# Altium project CPAP_POWER.PrjPcb (part 1 of 2)
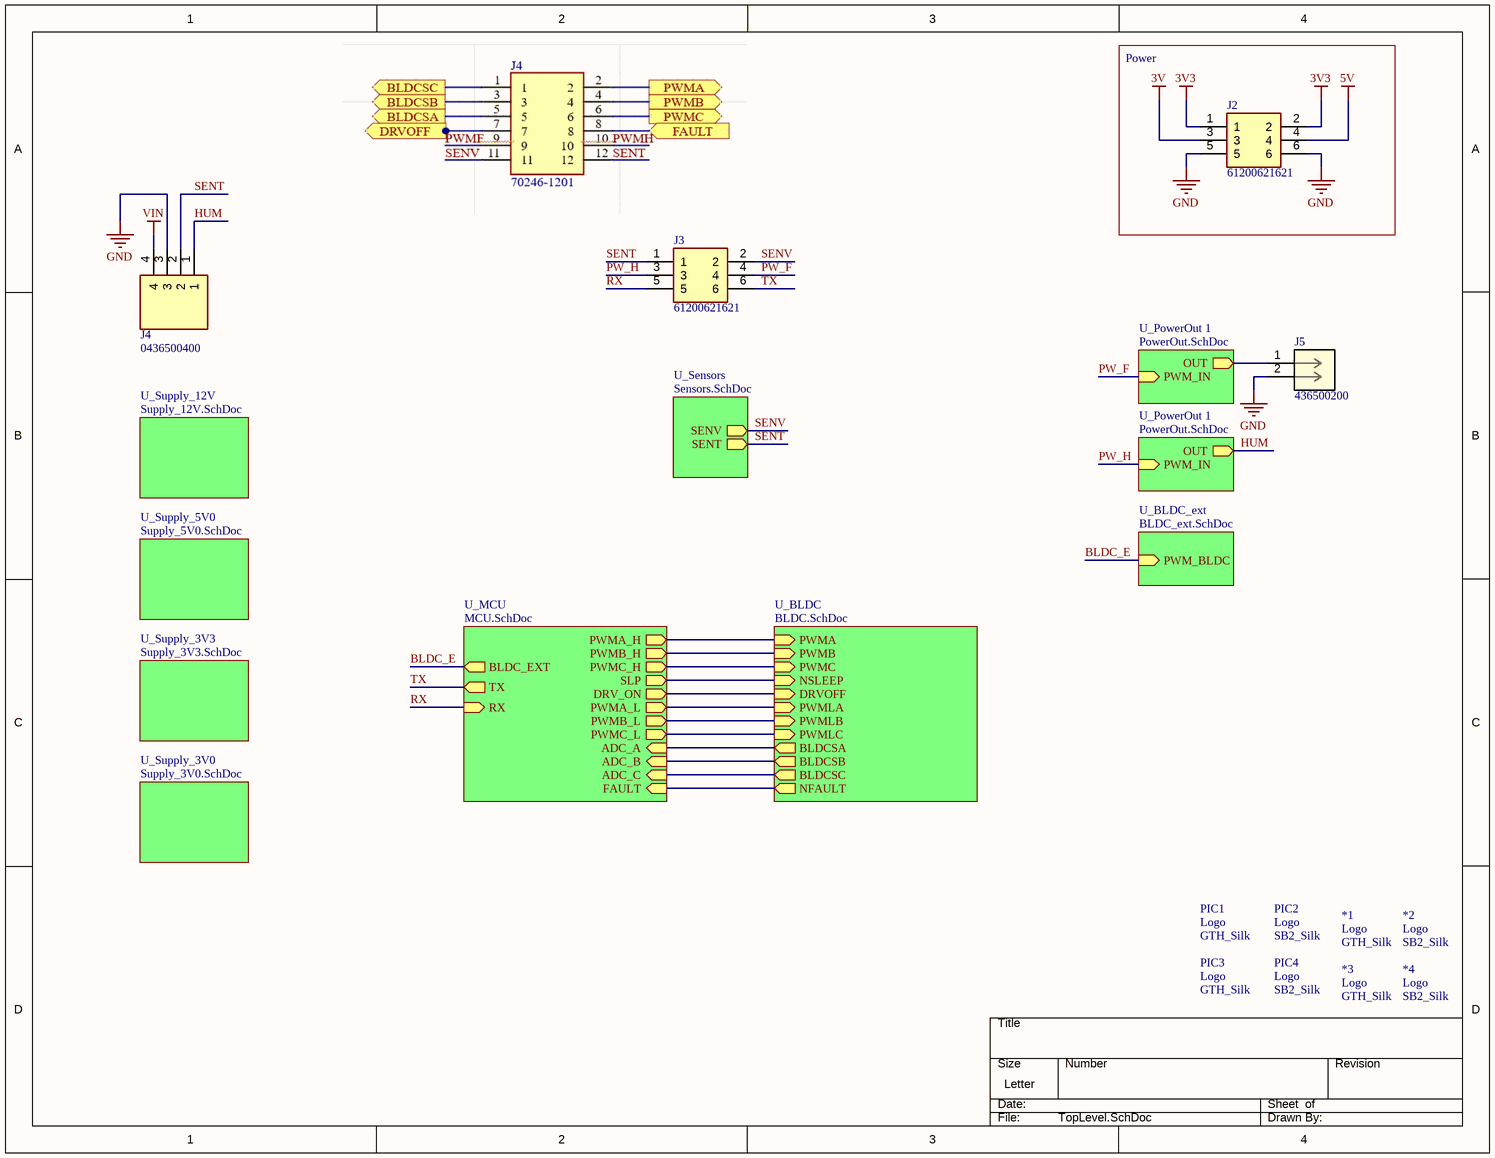
[diagram p0: TopLevel.SchDoc]
10 sheets, 101 parts. Net scope: hierarchical (ports join the sheet entries above them; power ports are global).
Board file: PCB_POWER.PcbDoc
Sheets:
  TopLevel.SchDoc
    U_Supply_5V0 = Supply_5V0.SchDoc
    U_Supply_12V = Supply_12V.SchDoc
    U_Supply_3V3 = Supply_3V3.SchDoc
    U_Supply_3V0 = Supply_3V0.SchDoc
    U_PowerOut 1 = PowerOut.SchDoc
    U_BLDC_ext = BLDC_ext.SchDoc
    U_BLDC = BLDC.SchDoc
    U_PowerOut 1 = PowerOut.SchDoc
    U_MCU = MCU.SchDoc
    U_Sensors = Sensors.SchDoc

## Sheet TopLevel.SchDoc
size Letter

### Parts
*1  GTH_Silk  [TECHHUB_SILK]
*2  SB2_Silk  [SMARTBEDDING2_SILK]
*3  GTH_Silk  [TECHHUB_SILK]
*4  SB2_Silk  [SMARTBEDDING2_SILK]
J2  61200621621  [SHDR6W64P254_2X3_1528X910X910P]
J3  61200621621  [SHDR6W64P254_2X3_1528X910X910P]
J4  0436500400  [MOLEX_0436500400]
J5  436500200  [CONN_SD-43650-001_02_MOL]
PIC1  GTH_Silk  [TECHHUB_SILK]
PIC2  SB2_Silk  [SMARTBEDDING2_SILK]
PIC3  GTH_Silk  [TECHHUB_SILK]
PIC4  SB2_Silk  [SMARTBEDDING2_SILK]

### Blocks framed on the sheet
Power: J2

### Sub-sheets
U_BLDC = BLDC.SchDoc: PWMA (in), PWMB (in), PWMC (in), NSLEEP (in), BLDCSA (out), BLDCSB (out), BLDCSC (out), NFAULT (out), DRVOFF (in), PWMLA (in), PWMLB (in), PWMLC (in)
U_BLDC_ext = BLDC_ext.SchDoc: PWM_BLDC (in)
U_MCU = MCU.SchDoc: PWMA_L (out), PWMB_L (out), PWMC_L (out), PWMA_H (out), PWMB_H (out), PWMC_H (out), ADC_A (in), ADC_B (in), ADC_C (in), FAULT (in), SLP (out), DRV_ON (out), BLDC_EXT (out), TX (out), RX (in)
U_PowerOut 1 = PowerOut.SchDoc: PWM_IN (in), OUT (out)
U_PowerOut 1 = PowerOut.SchDoc: PWM_IN (in), OUT (out)
U_Sensors = Sensors.SchDoc: SENV (out), SENT (out)
U_Supply_3V0 = Supply_3V0.SchDoc: no entries
U_Supply_3V3 = Supply_3V3.SchDoc: no entries
U_Supply_5V0 = Supply_5V0.SchDoc: no entries
U_Supply_12V = Supply_12V.SchDoc: no entries

### Nets
3V: J2.3
3V3: J2.1 J2.2
5V: J2.4
GND: J2.5 J2.6 J4.3 J5.2
VIN: J4.4
BLDC_E: sheet U_BLDC_ext/PWM_BLDC, sheet U_MCU/BLDC_EXT
FAULT: sheet U_BLDC/NFAULT, sheet U_MCU/FAULT
HUM: J4.1 ; sheet U_PowerOut 1/OUT
PW_F: J3.4 ; sheet U_PowerOut 1/PWM_IN
PW_H: J3.3 ; sheet U_PowerOut 1/PWM_IN
RX: J3.5 ; sheet U_MCU/RX
SENT: J3.1 J4.2 ; sheet U_Sensors/SENT
SENV: J3.2 ; sheet U_Sensors/SENV
TX: J3.6 ; sheet U_MCU/TX
NetC6_2: sheet U_BLDC/BLDCSA, sheet U_MCU/ADC_A
NetC7_2: sheet U_BLDC/BLDCSB, sheet U_MCU/ADC_B
NetC10_2: sheet U_BLDC/BLDCSC, sheet U_MCU/ADC_C
NetJ5_1: J5.1 ; sheet U_PowerOut 1/OUT
NetU1_21: sheet U_BLDC/DRVOFF, sheet U_MCU/DRV_ON
NetU1_23: sheet U_BLDC/NSLEEP, sheet U_MCU/SLP
NetU1_27: sheet U_BLDC/PWMA, sheet U_MCU/PWMA_H
NetU1_28: sheet U_BLDC/PWMLA, sheet U_MCU/PWMA_L
NetU1_29: sheet U_BLDC/PWMB, sheet U_MCU/PWMB_H
NetU1_30: sheet U_BLDC/PWMLB, sheet U_MCU/PWMB_L
NetU1_31: sheet U_BLDC/PWMC, sheet U_MCU/PWMC_H
NetU1_32: sheet U_BLDC/PWMLC, sheet U_MCU/PWMC_L

### Notes on the sheet
- DWG. NO.
- REV.
- SHT.
- REVISION
- DESCRIPTION
- DATE
- APPROVED
- THIS DOCUMENT AND THE DATA DISCLOSED HEREIN OR HEREWITH IS THE PROPERTY OF ALTIUM LIMITED AND MAY BE FREELY DISTRIBUTED IN WHOLE. NO RIGHTS ARE RESERVED OR EXPRESS OR IMPLIED WARANTEE GIVEN.
- ENG:
- DSN:
- APPROVALS
- PROJECT
- DOCUMENT REVISION:
- DESIGN ITEM:
- CHK:
- BOM:
- REFERENCE DOCUMENTS
- PROJECT REVISION:
- TITLE
- FAB DWG:
- PCB DWG:
- ASSY DWG:
- SCALE:
- SIZE
- C
- CAGE CODE
- FILE NAME
- DWG NO.
- SHEET
- OF
- REV
- (in symbol GTH_Silk) Logo
- (in symbol SB2_Silk) Logo

### Library data of the parts
J2 J3 = 61200621621: Wurth Elektronik PCB Header WR-BHD, 6 Way, 2.54mm Pitch, 2 Row, Straight, Through Hole; Geometry.Height: 9.1mm; Manufacturer_Name: Wurth Elektronik; Manufacturer_Part_Number: 61200621621; Mouser Part Number: 710-61200621621; Mouser Price/Stock: https://www.mouser.co.uk/ProductDetail/Wurth-Elektronik/61200621621?qs=PhR8RmCirEbjX8n1RKw4Jw%3D%3D; Arrow Part Number: *; Arrow Price/Stock: *; Datasheet Link: https://katalog.we-online.de/em/datasheet/6120xx21621.pdf
J4 = 0436500400: Micro-fit 3.0 Connector, 4 Circuit Single Row, Right Angle Throughhole PCB, Snap-In Peg; MF: Molex; MP: 0436500400; SnapEDA_Link: https://www.snapeda.com/parts/0436500400/Molex/view-part/1776823/?ref=snap; Price: None; Package: None; Availability: Unavailable; Value: *
J5 = 436500200: No Description Available; Mfr_Name: Molex Connector Corporation; RefDes: RefDes; Type: Type

## Sheet Supply_5V0.SchDoc
size Letter
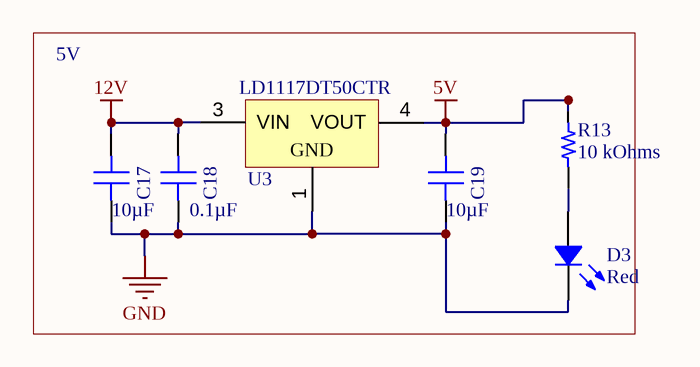
[diagram p1: Supply_5V0.SchDoc]

### Parts
C17  10µF  [CAP 0805_2012]
C18  Capacitance: 0.1µF  [CAP 0805_2012]
C19  10µF  [CAP 0805_2012]
D3  Red  [LED 0603_1608 RED]
R13  10 kOhms  [YAGEO RES 0603_1608]
U3  LD1117DT50CTR  [DPAK456P1010X240-3N]

### Blocks framed on the sheet
5V: C17-C19 D3 R13 U3

### Nets
5V: C19.1 R13.2 U3.4(VOUT)
12V: C17.1 C18.1 U3.3(VIN)
GND: C17.2 C18.2 C19.2 D3.2 U3.1(GND)
NetD3_1: D3.1 R13.1

### Notes on the sheet
- DWG. NO.
- REV.
- SHT.
- REVISION
- DESCRIPTION
- DATE
- APPROVED
- THIS DOCUMENT AND THE DATA DISCLOSED HEREIN OR HEREWITH IS THE PROPERTY OF ALTIUM LIMITED AND MAY BE FREELY DISTRIBUTED IN WHOLE. NO RIGHTS ARE RESERVED OR EXPRESS OR IMPLIED WARANTEE GIVEN.
- ENG:
- DSN:
- APPROVALS
- PROJECT
- DOCUMENT REVISION:
- DESIGN ITEM:
- CHK:
- BOM:
- REFERENCE DOCUMENTS
- PROJECT REVISION:
- TITLE
- FAB DWG:
- PCB DWG:
- ASSY DWG:
- SCALE:
- SIZE
- C
- CAGE CODE
- FILE NAME
- DWG NO.
- SHEET
- OF
- REV

### Library data of the parts
C17 C19 = 0805YD106KAT2A: CAP CER 10UF 16V X5R 0805; manufacturer: AVX Corporation; Tolerance: ±10%; value: 10µF; Part Number: 0805YD106KAT2A; Applications: General Purpose; componentlink1description: Datasheet; componentlink1url: http://datasheets.avx.com/cx5r.pdf; componentlink2description: DigiKey Link; componentlink2url: http://digikey.com/product-detail/en/avx-corporation/0805YD106KAT2A/478-5165-1-ND/1913255; Device Package: 0805 (2012 Metric); lastupdated: 2020-09-02 01:04:16; Lifecycle Status: Active; Minimum Order: 1; Mounting Type: Surface Mount, MLCC; Operating Temperature: -55°C ~ 85°C; Package / Case: 0805 (2012 Metric); packaging: TapeAndReel; partid: 15295; Part Status: Active; price: 0.16; series: -; Size / Dimension: 0.079" L x 0.049" W (2.01mm x 1.25mm); Supplier 1: DigiKey; Supplier Part Number 1: 478-5165-1-ND; Temperature Coefficient: X5R; Thickness (Max): 0.055" (1.40mm); Voltage - Rated: 16V
C18 = 08053E104ZAT2A: CAP CER 0.1UF 25V Z5U 0805; manufacturer: AVX Corporation; Tolerance: -20%, +80%; Part Number: 08053E104ZAT2A; Applications: General Purpose; componentlink2description: DigiKey Link; componentlink2url: http://digikey.com/product-detail/en/avx-corporation/08053E104ZAT2A/478-12769-1-ND/9949310; Device Package: 0805 (2012 Metric); lastupdated: 2020-09-02 01:04:40; Lifecycle Status: Active; Minimum Order: 1; Mounting Type: Surface Mount, MLCC; Operating Temperature: 10°C ~ 85°C; Package / Case: 0805 (2012 Metric); packaging: TapeAndReel; partid: 3602; Part Status: Active; price: 0.04; series: -; Size / Dimension: 0.079" L x 0.049" W (2.00mm x 1.25mm); Supplier 1: DigiKey; Supplier Part Number 1: 478-12769-1-ND; Temperature Coefficient: Z5U; Thickness (Max): 0.037" (0.94mm); Voltage - Rated: 25V
D3 = LR Q976.01-P2R2-1: LED RED CLEAR 0603 SMD; Manufacturer: ams-OSRAM USA Inc.; Current - Test: 20mA; Lens Color: Colorless; Lens Size: 1.10mm x 0.80mm; Lens Style: Rectangle with Flat Top; Millicandela Rating: 118mcd; Viewing Angle: 140°; Voltage - Forward (Vf) (Typ): 2V; Wavelength - Dominant: 623nm; Wavelength - Peak: 628nm; Part Number: LR Q976.01-P2R2-1; Color: Red; ComponentLink2Description: DigiKey Link; ComponentLink2URL: https://www.digikey.com/en/products/detail/ams-osram-usa-inc/LR-Q976-01-P2R2-1/21556490; Device Package: 0603 (1608 Metric); Height (Max): 0.75mm; LastUpdated: 2024-06-03 19:59:37; Lens Transparency: Clear; Lifecycle Status: Active; Minimum Order: 1; Mounting Type: Surface Mount; Package / Case: 0603 (1608 Metric); Packaging: TapeAndReel; PartId: 1467; Price: 0.02; Series: LO Q976.01; Size / Dimension: 1.60mm L x 0.80mm W; Supplier 1: DigiKey; Supplier Part Number 1: 475-LRQ976.01-P2R2-1CT-ND; Supplier Device Package: 0603; Value: Red
R13 = AC0603JR-0710KL: RES SMD 10K OHM 5% 1/10W 0603; Manufacturer: Yageo; Power (Watts): 0.1W, 1/10W; Temperature Coefficient: ±100ppm/°C; Part Number: AC0603JR-0710KL; Value: 10 kOhms; ComponentLink1Description: Datasheet; ComponentLink1URL: https://www.yageo.com/upload/media/product/productsearch/datasheet/rchip/PYu-AC_51_RoHS_L_7.pdf; ComponentLink2Description: DigiKey Link; ComponentLink2URL: https://www.digikey.com/en/products/detail/yageo/AC0603JR-0710KL/2827830; Composition: Thick Film; Device Package: 0603 (1608 Metric); Features: Automotive AEC-Q200, Moisture Resistant; Height - Seated (Max): 0.022" (0.55mm); LastUpdated: 2024-07-25 09:19:28; Lifecycle Status: Active; Minimum Order: 1; Number of Terminations: 2; Operating Temperature: -55°C ~ 155°C; Package / Case: 0603 (1608 Metric); Packaging: CutTape; PartId: 12247; Part Status: Active; Price: 0.01; Ratings: AEC-Q200; Resistance: 10 kOhms; Series: AC; Size / Dimension: 0.063" L x 0.031" W (1.60mm x 0.80mm); Supplier 1: DigiKey; Supplier Part Number 1: 311-10KLECT-ND; Supplier Device Package: 0603; Tolerance: ±5%
U3 = LD1117DT50CTR: Fixed Low Drop Positive Voltage Regulator, 5V, 3-Pin DPAK, Tape and Reel; ComponentLink1Description: Manufacturer URL; ComponentLink2Description: Datasheet; DatasheetVersion: 1/11/2011; ComponentLink1URL: http://www.st.com; PackageVersion: 2011; PackageDescription: 3-Pin Transistor Outline Package 2.28 mm Pitch, 9.7 mm Lead Span (DPAK); ComponentLink2URL: http://www.st.com/internet/com/TECHNICAL_RESOURCES/TECHNICAL_LITERATURE/DATASHEET/CD00000544.pdf; PackageReference: TO-252; PartNumber: LD1117DT50CTR

## Sheet Supply_12V.SchDoc
size Letter
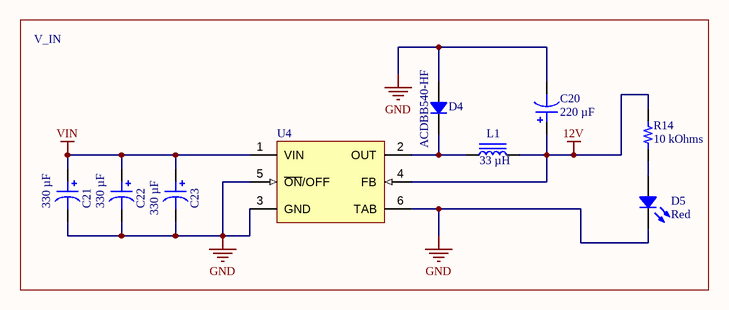
[diagram p2: Supply_12V.SchDoc]

### Parts
C20  220 µF  [CAP ALSMD 8.3MM H10.5MM]
C21  330 µF  [CAP ALSMD 8.3MM H10.5MM]
C22  330 µF  [CAP ALSMD 8.3MM H10.5MM]
C23  330 µF  [CAP ALSMD 8.3MM H10.5MM]
D4  ACDBB540-HF  [DO214AA SMB]
D5  Red  [LED 0603_1608 RED]
L1  33 µH  [BOURNS SRR1280]
R14  10 kOhms  [YAGEO RES 0603_1608]
U4  (no value)  [KTT0005B_M]

### Blocks framed on the sheet
V_IN: C20-C23 D4 D5 L1 R14 U4

### Nets
12V: C20.1 L1.2 R14.2 U4.4(FB)
GND: C20.2 C21.2 C22.2 C23.2 D4.1 D5.2 U4.3(GND) U4.5(~{ON}/OFF) U4.6(TAB)
VIN: C21.1 C22.1 C23.1 U4.1(VIN)
NetD4_2: D4.2 L1.1 U4.2(OUT)
NetD5_1: D5.1 R14.1

### Notes on the sheet
- DWG. NO.
- REV.
- SHT.
- REVISION
- DESCRIPTION
- DATE
- APPROVED
- THIS DOCUMENT AND THE DATA DISCLOSED HEREIN OR HEREWITH IS THE PROPERTY OF ALTIUM LIMITED AND MAY BE FREELY DISTRIBUTED IN WHOLE. NO RIGHTS ARE RESERVED OR EXPRESS OR IMPLIED WARANTEE GIVEN.
- ENG:
- DSN:
- APPROVALS
- PROJECT
- DOCUMENT REVISION:
- DESIGN ITEM:
- CHK:
- BOM:
- REFERENCE DOCUMENTS
- PROJECT REVISION:
- TITLE
- FAB DWG:
- PCB DWG:
- ASSY DWG:
- SCALE:
- SIZE
- C
- CAGE CODE
- FILE NAME
- DWG NO.
- SHEET
- OF
- REV

### Library data of the parts
C20 = 25SKV220M8X10.5: CAP ALUM 220UF 20% 25V SMD; manufacturer: Rubycon; Lifetime @ Temp.: 1000 Hrs @ 105°C; Polarization: Polar; Ripple Current @ High Frequency: 228 mA @ 10 kHz; Ripple Current @ Low Frequency: 190 mA @ 120 Hz; Surface Mount Land Size: 0.327" L x 0.327" W (8.30mm x 8.30mm); componentlink2url: https://www.digikey.com/en/products/detail/rubycon/25SKV220M8X10-5/3568724; componentlink1description: Datasheet; componentlink1url: http://www.rubycon.co.jp/en/catalog/e_pdfs/aluminum/e_SKV.pdf; componentlink2description: DigiKey Link; packaging: TapeAndReel; Part Number: 25SKV220M8X10.5; Applications: General Purpose; Capacitance: 220 µF; Device Package: Radial, Can - SMD; Height - Seated (Max): 0.413" (10.50mm); lastupdated: 2024-06-03 20:15:46; Lifecycle Status: Active; Minimum Order: 1; Mounting Type: Surface Mount; Operating Temperature: -55°C ~ 105°C; Package / Case: Radial, Can - SMD; partid: 7651; Part Status: Active; price: 0.12; series: SKV; Size / Dimension: 0.315" Dia (8.00mm); Supplier 1: DigiKey; Supplier Part Number 1: 1189-3082-1-ND; Tolerance: ±20%; value: 220 µF; Voltage - Rated: 25 V
C21-C23 = EMZS350ARA331MHA0G: CAP ALUM 330UF 20% 35V SMD; manufacturer: United Chemi-Con; ESR (Equivalent Series Resistance): 80mOhm @ 100kHz; Lifetime @ Temp.: 2000 Hrs @ 105°C; Polarization: Polar; Ripple Current @ High Frequency: 850 mA @ 100 kHz; Ripple Current @ Low Frequency: 425 mA @ 120 Hz; Surface Mount Land Size: 0.327" L x 0.327" W (8.30mm x 8.30mm); Part Number: EMZS350ARA331MHA0G; Applications: Automotive; Capacitance: 330 µF; componentlink1description: Datasheet; componentlink1url: //media.digikey.com/pdf/Data%20Sheets/United%20Chemi-Con%20PDFs/MZS_Series_NPI.pdf; componentlink2description: DigiKey Link; componentlink2url: https://www.digikey.com/en/products/detail/united-chemi-con/EMZS350ARA331MHA0G/8637077; Device Package: Radial, Can - SMD; Height - Seated (Max): 0.413" (10.50mm); lastupdated: 2024-06-03 20:15:47; Lifecycle Status: Active; Minimum Order: 1; Mounting Type: Surface Mount; Operating Temperature: -55°C ~ 105°C; Package / Case: Radial, Can - SMD; packaging: TapeAndReel; partid: 7592; Part Status: Active; price: 0.30; Ratings: AEC-Q200; series: Alchip™- MZS; Size / Dimension: 0.315" Dia (8.00mm); Supplier 1: DigiKey; Supplier Part Number 1: 565-5121-1-ND; Tolerance: ±20%; value: 330 µF; Voltage - Rated: 35 V
D4 = ACDBB540-HF: DIODE SCHOTTKY 40V 5A DO214AA; Manufacturer: Comchip Technology; Capacitance @ Vr, F: 300pF @ 4V, 1MHz; Current - Reverse Leakage @ Vr: 500 µA @ 40 V; Speed: Fast Recovery =< 500ns, > 200mA (Io); Voltage - Forward (Vf) (Max) @ If: 550 mV @ 5 A; Part Number: ACDBB540-HF; ComponentLink1Description: Datasheet; ComponentLink1URL: http://www.comchiptech.com/admin/files/product/ACDBB540-HF%20RevA196617.pdf; ComponentLink2Description: DigiKey Link; ComponentLink2URL: https://www.digikey.com/en/products/detail/comchip-technology/ACDBB540-HF/7100744; Current - Average Rectified (Io): 5A; Diode Type: Schottky; LastUpdated: 2024-06-03 19:54:00; Lifecycle Status: Active; Minimum Order: 1; Mounting Type: Surface Mount; Operating Temperature - Junction: -55°C ~ 125°C; Package / Case: DO-214AA, SMB; Packaging: TapeAndReel; PartId: 1496; Part Status: Active; Price: 0.18; Series: -; Supplier 1: DigiKey; Supplier Part Number 1: 641-1898-1-ND; Supplier Device Package: DO-214AA (SMB); Voltage - DC Reverse (Vr) (Max): 40 V
D5 = LR Q976.01-P2R2-1: as D3 on sheet Supply_5V0; Part Number: LR Q976.01-P2R2-1; Color: Red; ComponentLink2Description: DigiKey Link; ComponentLink2URL: https://www.digikey.com/en/products/detail/ams-osram-usa-inc/LR-Q976-01-P2R2-1/21556490; Device Package: 0603 (1608 Metric); Height (Max): 0.75mm; LastUpdated: 2024-06-03 19:59:37; Lens Transparency: Clear; Lifecycle Status: Active; Minimum Order: 1; Mounting Type: Surface Mount; Package / Case: 0603 (1608 Metric); Packaging: TapeAndReel; PartId: 1467; Price: 0.02; Series: LO Q976.01; Size / Dimension: 1.60mm L x 0.80mm W; Supplier 1: DigiKey; Supplier Part Number 1: 475-LRQ976.01-P2R2-1CT-ND; Supplier Device Package: 0603; Value: Red
L1 = SRR1280-330M: FIXED IND 33UH 3.5A 57 MOHM SMD; Manufacturer: Bourns Inc.; Shielding: Shielded; Tolerance: ±20%; DC Resistance (DCR): 57mOhm Max; Current - Saturation: 3.3A; Frequency - Self Resonant: 9.5MHz; Inductance Frequency - Test: 100 kHz; Material - Core: Ferrite; Q @ Freq: 28 @ 2.52MHz; Type: Drum Core, Wirewound; Series: SRR1280; Height - Seated (Max): 0.315" (8.00mm); Inductance: 33 µH; Packaging: TapeAndReel; Part Number: SRR1280-330M; ComponentLink1Description: Datasheet; ComponentLink1URL: https://www.bourns.com/docs/Product-Datasheets/SRR1280.pdf; ComponentLink2Description: DigiKey Link; ComponentLink2URL: https://www.digikey.com/en/products/detail/bourns-inc/SRR1280-330M/1969998; Current Rating (Amps): 3.5 A; Device Package: Nonstandard; LastUpdated: 2024-11-25 00:45:31; Lifecycle Status: Active; Minimum Order: 1; Mounting Type: Surface Mount; Operating Temperature: -40°C ~ 125°C; Package / Case: Nonstandard; PartId: 25; Part Status: Active; Price: 0.45; Size / Dimension: 0.492" L x 0.492" W (12.50mm x 12.50mm); Supplier 1: DigiKey; Supplier Part Number 1: SRR1280-330MCT-ND; Value: 33 µH
R14 = AC0603JR-0710KL: as R13 on sheet Supply_5V0; Part Number: AC0603JR-0710KL; Value: 10 kOhms; ComponentLink1Description: Datasheet; ComponentLink1URL: https://www.yageo.com/upload/media/product/productsearch/datasheet/rchip/PYu-AC_51_RoHS_L_7.pdf; ComponentLink2Description: DigiKey Link; ComponentLink2URL: https://www.digikey.com/en/products/detail/yageo/AC0603JR-0710KL/2827830; Composition: Thick Film; Device Package: 0603 (1608 Metric); Features: Automotive AEC-Q200, Moisture Resistant; Height - Seated (Max): 0.022" (0.55mm); LastUpdated: 2024-07-25 09:19:28; Lifecycle Status: Active; Minimum Order: 1; Number of Terminations: 2; Operating Temperature: -55°C ~ 155°C; Package / Case: 0603 (1608 Metric); Packaging: CutTape; PartId: 12247; Part Status: Active; Price: 0.01; Ratings: AEC-Q200; Resistance: 10 kOhms; Series: AC; Size / Dimension: 0.063" L x 0.031" W (1.60mm x 0.80mm); Supplier 1: DigiKey; Supplier Part Number 1: 311-10KLECT-ND; Supplier Device Package: 0603; Tolerance: ±5%
U4 = LM2576S-12/NOPB: SIMPLE SWITCHER® 3A Step-Down Voltage Regulator, 5-pin TO-263, Pb-Free; Manufacturer: Texas Instruments; PackageTopMarking: NSUZXYTTE#*LM2576S*-12 P+; PowerWise: N; ComponentLink1Description: Datasheet URL; PinCount: 5; ComponentLink1URL: http://www.ti.com/general/docs/lit/getliterature.tsp?genericPartNumber=LM2576&fileType=pdf; Code_JEDEC: MO-169-AB; PackageReference: KTT0005B; PackageDescription: TO-263, Molded, .400 x .390 x .180in, 5 Lead, .067in Pitch, Surface Mount; CompType: Switcher; RoHS: Y

## Sheet Supply_3V3.SchDoc
size Letter
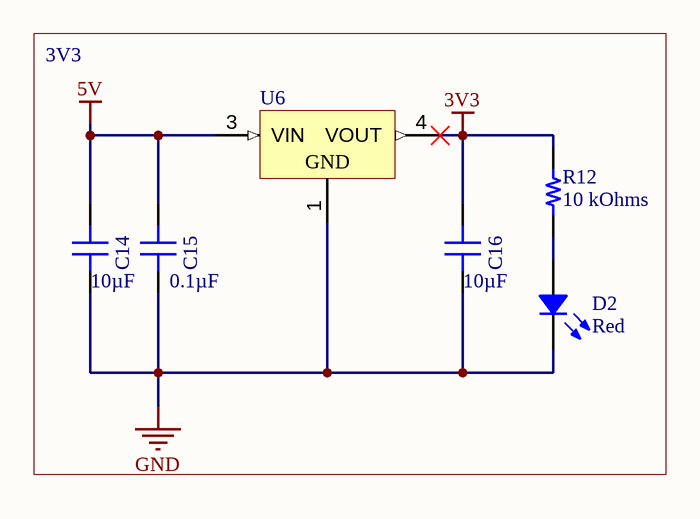
[diagram p3: Supply_3V3.SchDoc]

### Parts
C14  10µF  [CAP 0805_2012]
C15  Capacitance: 0.1µF  [CAP 0805_2012]
C16  10µF  [CAP 0805_2012]
D2  Red  [LED 0603_1608 RED]
R12  10 kOhms  [YAGEO RES 0603_1608]
U6  (no value)  [DPAK456P1010X240-3N]

### Blocks framed on the sheet
3V3: C14-C16 D2 R12 U6

### Nets
3V3: C16.1 R12.2 U6.4(VOUT)
5V: C14.1 C15.1 U6.3(VIN)
GND: C14.2 C15.2 C16.2 D2.2 U6.1(GND)
NetD2_1: D2.1 R12.1

### Notes on the sheet
- DWG. NO.
- REV.
- SHT.
- REVISION
- DESCRIPTION
- DATE
- APPROVED
- THIS DOCUMENT AND THE DATA DISCLOSED HEREIN OR HEREWITH IS THE PROPERTY OF ALTIUM LIMITED AND MAY BE FREELY DISTRIBUTED IN WHOLE. NO RIGHTS ARE RESERVED OR EXPRESS OR IMPLIED WARANTEE GIVEN.
- ENG:
- DSN:
- APPROVALS
- PROJECT
- DOCUMENT REVISION:
- DESIGN ITEM:
- CHK:
- BOM:
- REFERENCE DOCUMENTS
- PROJECT REVISION:
- TITLE
- FAB DWG:
- PCB DWG:
- ASSY DWG:
- SCALE:
- SIZE
- C
- CAGE CODE
- FILE NAME
- DWG NO.
- SHEET
- OF
- REV

### Library data of the parts
C14 C16 = 0805YD106KAT2A: as C17 on sheet Supply_5V0; value: 10µF; Part Number: 0805YD106KAT2A; Applications: General Purpose; componentlink1description: Datasheet; componentlink1url: http://datasheets.avx.com/cx5r.pdf; componentlink2description: DigiKey Link; componentlink2url: http://digikey.com/product-detail/en/avx-corporation/0805YD106KAT2A/478-5165-1-ND/1913255; Device Package: 0805 (2012 Metric); lastupdated: 2020-09-02 01:04:16; Lifecycle Status: Active; Minimum Order: 1; Mounting Type: Surface Mount, MLCC; Operating Temperature: -55°C ~ 85°C; Package / Case: 0805 (2012 Metric); packaging: TapeAndReel; partid: 15295; Part Status: Active; price: 0.16; series: -; Size / Dimension: 0.079" L x 0.049" W (2.01mm x 1.25mm); Supplier 1: DigiKey; Supplier Part Number 1: 478-5165-1-ND; Temperature Coefficient: X5R; Thickness (Max): 0.055" (1.40mm); Voltage - Rated: 16V
C15 = 08053E104ZAT2A: as C18 on sheet Supply_5V0; Part Number: 08053E104ZAT2A; Applications: General Purpose; componentlink2description: DigiKey Link; componentlink2url: http://digikey.com/product-detail/en/avx-corporation/08053E104ZAT2A/478-12769-1-ND/9949310; Device Package: 0805 (2012 Metric); lastupdated: 2020-09-02 01:04:40; Lifecycle Status: Active; Minimum Order: 1; Mounting Type: Surface Mount, MLCC; Operating Temperature: 10°C ~ 85°C; Package / Case: 0805 (2012 Metric); packaging: TapeAndReel; partid: 3602; Part Status: Active; price: 0.04; series: -; Size / Dimension: 0.079" L x 0.049" W (2.00mm x 1.25mm); Supplier 1: DigiKey; Supplier Part Number 1: 478-12769-1-ND; Temperature Coefficient: Z5U; Thickness (Max): 0.037" (0.94mm); Voltage - Rated: 25V
D2 = LR Q976.01-P2R2-1: as D3 on sheet Supply_5V0; Part Number: LR Q976.01-P2R2-1; Color: Red; ComponentLink2Description: DigiKey Link; ComponentLink2URL: https://www.digikey.com/en/products/detail/ams-osram-usa-inc/LR-Q976-01-P2R2-1/21556490; Device Package: 0603 (1608 Metric); Height (Max): 0.75mm; LastUpdated: 2024-06-03 19:59:37; Lens Transparency: Clear; Lifecycle Status: Active; Minimum Order: 1; Mounting Type: Surface Mount; Package / Case: 0603 (1608 Metric); Packaging: TapeAndReel; PartId: 1467; Price: 0.02; Series: LO Q976.01; Size / Dimension: 1.60mm L x 0.80mm W; Supplier 1: DigiKey; Supplier Part Number 1: 475-LRQ976.01-P2R2-1CT-ND; Supplier Device Package: 0603; Value: Red
R12 = AC0603JR-0710KL: as R13 on sheet Supply_5V0; Part Number: AC0603JR-0710KL; Value: 10 kOhms; ComponentLink1Description: Datasheet; ComponentLink1URL: https://www.yageo.com/upload/media/product/productsearch/datasheet/rchip/PYu-AC_51_RoHS_L_7.pdf; ComponentLink2Description: DigiKey Link; ComponentLink2URL: https://www.digikey.com/en/products/detail/yageo/AC0603JR-0710KL/2827830; Composition: Thick Film; Device Package: 0603 (1608 Metric); Features: Automotive AEC-Q200, Moisture Resistant; Height - Seated (Max): 0.022" (0.55mm); LastUpdated: 2024-07-25 09:19:28; Lifecycle Status: Active; Minimum Order: 1; Number of Terminations: 2; Operating Temperature: -55°C ~ 155°C; Package / Case: 0603 (1608 Metric); Packaging: CutTape; PartId: 12247; Part Status: Active; Price: 0.01; Ratings: AEC-Q200; Resistance: 10 kOhms; Series: AC; Size / Dimension: 0.063" L x 0.031" W (1.60mm x 0.80mm); Supplier 1: DigiKey; Supplier Part Number 1: 311-10KLECT-ND; Supplier Device Package: 0603; Tolerance: ±5%
U6 = LD1117DT33TR: Linear Voltage Regulator IC 1 Output 800mA DPAK; MF: STMicroelectronics; Package: TO-252 STMicroelectronics; Value: *; MP: LD1117DT33TR; Price: None; SnapEDA_Link: https://www.snapeda.com/parts/LD1117DT33TR/STMicroelectronics/view-part/8105/?ref=snap; Availability: Unavailable

## Sheet Supply_3V0.SchDoc
size Letter
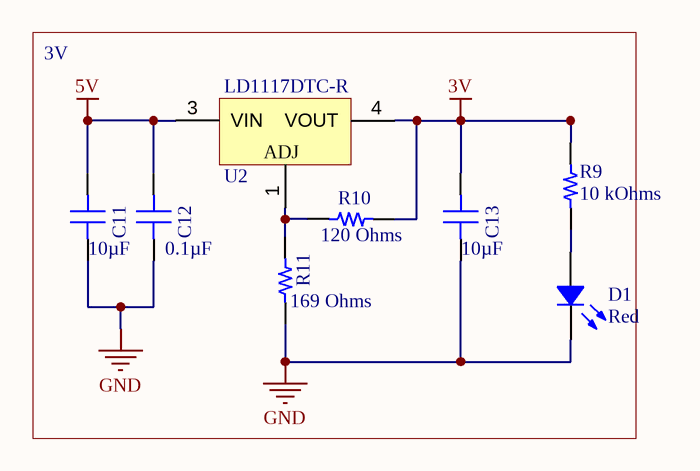
[diagram p4: Supply_3V0.SchDoc]

### Parts
C11  10µF  [CAP 0805_2012]
C12  Capacitance: 0.1µF  [CAP 0805_2012]
C13  10µF  [CAP 0805_2012]
D1  Red  [LED 0603_1608 RED]
R9  10 kOhms  [YAGEO RES 0603_1608]
R10  120 Ohms  [YAGEO RES 0603_1608]
R11  169 Ohms  [YAGEO RES 0603_1608]
U2  LD1117DTC-R  [DPAK456P1010X240-3N]

### Blocks framed on the sheet
3V: C11-C13 D1 R9-R11 U2

### Nets
3V: C13.1 R9.2 R10.2 U2.4(VOUT)
5V: C11.1 C12.1 U2.3(VIN)
GND: C11.2 C12.2 C13.2 D1.2 R11.2
NetD1_1: D1.1 R9.1
NetR10_1: R10.1 R11.1 U2.1(GND)

### Notes on the sheet
- DWG. NO.
- REV.
- SHT.
- REVISION
- DESCRIPTION
- DATE
- APPROVED
- THIS DOCUMENT AND THE DATA DISCLOSED HEREIN OR HEREWITH IS THE PROPERTY OF ALTIUM LIMITED AND MAY BE FREELY DISTRIBUTED IN WHOLE. NO RIGHTS ARE RESERVED OR EXPRESS OR IMPLIED WARANTEE GIVEN.
- ENG:
- DSN:
- APPROVALS
- PROJECT
- DOCUMENT REVISION:
- DESIGN ITEM:
- CHK:
- BOM:
- REFERENCE DOCUMENTS
- PROJECT REVISION:
- TITLE
- FAB DWG:
- PCB DWG:
- ASSY DWG:
- SCALE:
- SIZE
- C
- CAGE CODE
- FILE NAME
- DWG NO.
- SHEET
- OF
- REV
- (in symbol LD1117DTC-R) ADJ

### Library data of the parts
C11 C13 = 0805YD106KAT2A: as C17 on sheet Supply_5V0; value: 10µF; Part Number: 0805YD106KAT2A; Applications: General Purpose; componentlink1description: Datasheet; componentlink1url: http://datasheets.avx.com/cx5r.pdf; componentlink2description: DigiKey Link; componentlink2url: http://digikey.com/product-detail/en/avx-corporation/0805YD106KAT2A/478-5165-1-ND/1913255; Device Package: 0805 (2012 Metric); lastupdated: 2020-09-02 01:04:16; Lifecycle Status: Active; Minimum Order: 1; Mounting Type: Surface Mount, MLCC; Operating Temperature: -55°C ~ 85°C; Package / Case: 0805 (2012 Metric); packaging: TapeAndReel; partid: 15295; Part Status: Active; price: 0.16; series: -; Size / Dimension: 0.079" L x 0.049" W (2.01mm x 1.25mm); Supplier 1: DigiKey; Supplier Part Number 1: 478-5165-1-ND; Temperature Coefficient: X5R; Thickness (Max): 0.055" (1.40mm); Voltage - Rated: 16V
C12 = 08053E104ZAT2A: as C18 on sheet Supply_5V0; Part Number: 08053E104ZAT2A; Applications: General Purpose; componentlink2description: DigiKey Link; componentlink2url: http://digikey.com/product-detail/en/avx-corporation/08053E104ZAT2A/478-12769-1-ND/9949310; Device Package: 0805 (2012 Metric); lastupdated: 2020-09-02 01:04:40; Lifecycle Status: Active; Minimum Order: 1; Mounting Type: Surface Mount, MLCC; Operating Temperature: 10°C ~ 85°C; Package / Case: 0805 (2012 Metric); packaging: TapeAndReel; partid: 3602; Part Status: Active; price: 0.04; series: -; Size / Dimension: 0.079" L x 0.049" W (2.00mm x 1.25mm); Supplier 1: DigiKey; Supplier Part Number 1: 478-12769-1-ND; Temperature Coefficient: Z5U; Thickness (Max): 0.037" (0.94mm); Voltage - Rated: 25V
D1 = LR Q976.01-P2R2-1: as D3 on sheet Supply_5V0; Part Number: LR Q976.01-P2R2-1; Color: Red; ComponentLink2Description: DigiKey Link; ComponentLink2URL: https://www.digikey.com/en/products/detail/ams-osram-usa-inc/LR-Q976-01-P2R2-1/21556490; Device Package: 0603 (1608 Metric); Height (Max): 0.75mm; LastUpdated: 2024-06-03 19:59:37; Lens Transparency: Clear; Lifecycle Status: Active; Minimum Order: 1; Mounting Type: Surface Mount; Package / Case: 0603 (1608 Metric); Packaging: TapeAndReel; PartId: 1467; Price: 0.02; Series: LO Q976.01; Size / Dimension: 1.60mm L x 0.80mm W; Supplier 1: DigiKey; Supplier Part Number 1: 475-LRQ976.01-P2R2-1CT-ND; Supplier Device Package: 0603; Value: Red
R9 = AC0603JR-0710KL: as R13 on sheet Supply_5V0; Part Number: AC0603JR-0710KL; Value: 10 kOhms; ComponentLink1Description: Datasheet; ComponentLink1URL: https://www.yageo.com/upload/media/product/productsearch/datasheet/rchip/PYu-AC_51_RoHS_L_7.pdf; ComponentLink2Description: DigiKey Link; ComponentLink2URL: https://www.digikey.com/en/products/detail/yageo/AC0603JR-0710KL/2827830; Composition: Thick Film; Device Package: 0603 (1608 Metric); Features: Automotive AEC-Q200, Moisture Resistant; Height - Seated (Max): 0.022" (0.55mm); LastUpdated: 2024-07-25 09:19:28; Lifecycle Status: Active; Minimum Order: 1; Number of Terminations: 2; Operating Temperature: -55°C ~ 155°C; Package / Case: 0603 (1608 Metric); Packaging: CutTape; PartId: 12247; Part Status: Active; Price: 0.01; Ratings: AEC-Q200; Resistance: 10 kOhms; Series: AC; Size / Dimension: 0.063" L x 0.031" W (1.60mm x 0.80mm); Supplier 1: DigiKey; Supplier Part Number 1: 311-10KLECT-ND; Supplier Device Package: 0603; Tolerance: ±5%
R10 = RT0603DRE07120RL: RES SMD 120 OHM 0.5% 1/10W 0603; Manufacturer: Yageo; Power (Watts): 0.1W, 1/10W; Temperature Coefficient: ±50ppm/°C; Tolerance: ±0.5%; Value: 120 Ohms; Part Number: RT0603DRE07120RL; ComponentLink1Description: Datasheet; ComponentLink1URL: https://www.yageo.com/upload/media/product/productsearch/datasheet/rchip/PYu-RT_1-to-0.01_RoHS_L_11.pdf; ComponentLink2Description: DigiKey Link; ComponentLink2URL: https://www.digikey.com/en/products/detail/yageo/RT0603DRE07120RL/1074551; Composition: Thin Film; Device Package: 0603 (1608 Metric); Height - Seated (Max): 0.022" (0.55mm); LastUpdated: 2024-07-25 09:19:30; Lifecycle Status: Active; Minimum Order: 1; Number of Terminations: 2; Operating Temperature: -55°C ~ 155°C; Package / Case: 0603 (1608 Metric); Packaging: TapeAndReel; PartId: 9567; Part Status: Active; Price: 0.01; Resistance: 120 Ohms; Series: RT; Size / Dimension: 0.063" L x 0.031" W (1.60mm x 0.80mm); Supplier 1: DigiKey; Supplier Part Number 1: 311-2409-1-ND; Supplier Device Package: 0603
R11 = RT0603DRE07169RL: RES SMD 169 OHM 0.5% 1/10W 0603; Manufacturer: Yageo; Power (Watts): 0.1W, 1/10W; Temperature Coefficient: ±50ppm/°C; Tolerance: ±0.5%; Value: 169 Ohms; Part Number: RT0603DRE07169RL; ComponentLink1Description: Datasheet; ComponentLink1URL: https://www.yageo.com/upload/media/product/productsearch/datasheet/rchip/PYu-RT_1-to-0.01_RoHS_L_11.pdf; ComponentLink2Description: DigiKey Link; ComponentLink2URL: https://www.digikey.com/en/products/detail/yageo/RT0603DRE07169RL/1074609; Composition: Thin Film; Device Package: 0603 (1608 Metric); Height - Seated (Max): 0.022" (0.55mm); LastUpdated: 2024-07-25 09:19:29; Lifecycle Status: Active; Minimum Order: 1; Number of Terminations: 2; Operating Temperature: -55°C ~ 155°C; Package / Case: 0603 (1608 Metric); Packaging: TapeAndReel; PartId: 10004; Part Status: Active; Price: 0.01; Resistance: 169 Ohms; Series: RT; Size / Dimension: 0.063" L x 0.031" W (1.60mm x 0.80mm); Supplier 1: DigiKey; Supplier Part Number 1: 311-2439-1-ND; Supplier Device Package: 0603
U2 = LD1117DTC-R: Adjustable Low Drop Voltage Regulator, 1.25 to 15V, 3-Pin DPAK, Tape and Reel; ComponentLink1Description: Manufacturer URL; ComponentLink2Description: Datasheet; DatasheetVersion: 1/11/2011; ComponentLink1URL: http://www.st.com; PackageVersion: 2011; PackageDescription: 3-Pin Transistor Outline Package 2.28 mm Pitch, 9.7 mm Lead Span (DPAK); ComponentLink2URL: http://www.st.com/internet/com/TECHNICAL_RESOURCES/TECHNICAL_LITERATURE/DATASHEET/CD00000544.pdf; PackageReference: TO-252; PartNumber: LD1117DTC-R

## Sheet PowerOut.SchDoc
size Letter
Used 2 times, as channels U_PowerOut 1, U_PowerOut 1. Parts and nets are listed once, with the designators drawn on the sheet.
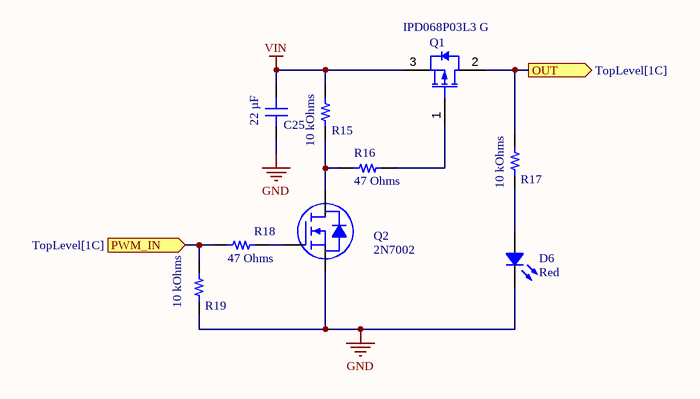
[diagram p5: PowerOut.SchDoc]

### Parts
C25  22 µF  [CAP 0805_2012]
D6  Red  [LED 0603_1608 RED]
Q1  IPD068P03L3 G  [INF-PG-TO252-3-1_M]
Q2  2N7002  [ON SEMI SOT-23-3]
R15  10 kOhms  [YAGEO RES 0603_1608]
R16  47 Ohms  [YAGEO RES 0603_1608]
R17  10 kOhms  [YAGEO RES 0603_1608]
R18  47 Ohms  [YAGEO RES 0603_1608]
R19  10 kOhms  [YAGEO RES 0603_1608]

### Ports
OUT (out, see TopLevel[1C]), PWM_IN (in, see TopLevel[1C])

### Nets
GND: C25.2 D6.2 Q2.2(S) R19.2
VIN: C25.1 Q1.3(SOURCE) R15.1
OUT: Q1.2(DRAIN) R17.1 ; port OUT
PWM_IN: R18.1 R19.1 ; port PWM_IN
NetD6_1: D6.1 R17.2
NetQ1_1: Q1.1(GATE) R16.2
NetQ2_1: Q2.1(G) R18.2
NetQ2_3: Q2.3(D) R15.2 R16.1

### Channels
U_PowerOut 1: designators end in _2; ports OUT=HUM PWM_IN=PW_H
U_PowerOut 1: designators end in _1; ports OUT=NetJ5_1 PWM_IN=PW_F

### Notes on the sheet
- DWG. NO.
- REV.
- SHT.
- REVISION
- DESCRIPTION
- DATE
- APPROVED
- THIS DOCUMENT AND THE DATA DISCLOSED HEREIN OR HEREWITH IS THE PROPERTY OF ALTIUM LIMITED AND MAY BE FREELY DISTRIBUTED IN WHOLE. NO RIGHTS ARE RESERVED OR EXPRESS OR IMPLIED WARANTEE GIVEN.
- ENG:
- DSN:
- APPROVALS
- PROJECT
- DOCUMENT REVISION:
- DESIGN ITEM:
- CHK:
- BOM:
- REFERENCE DOCUMENTS
- PROJECT REVISION:
- TITLE
- FAB DWG:
- PCB DWG:
- ASSY DWG:
- SCALE:
- SIZE
- C
- CAGE CODE
- FILE NAME
- DWG NO.
- SHEET
- OF
- REV

### Library data of the parts
C25 = GMC21X5R226M35NT: CAP0805 X5R 22UF 20% 35V; manufacturer: Cal-Chip Electronics, Inc.; Tolerance: ±20%; value: 22 µF; Part Number: GMC21X5R226M35NT; Applications: General Purpose; componentlink1description: Datasheet; componentlink1url: https://88ce57.p3cdn1.secureserver.net/wp-content/uploads/2023/01/gmc_series-2.pdf; componentlink2description: DigiKey Link; componentlink2url: https://www.digikey.com/en/products/detail/cal-chip-electronics-inc/GMC21X5R226M35NT/18151151; Device Package: 0805 (2012 Metric); lastupdated: 2024-02-09 20:14:42; Lifecycle Status: Active; Minimum Order: 1; Mounting Type: Surface Mount, MLCC; Operating Temperature: -55°C ~ 85°C; Package / Case: 0805 (2012 Metric); packaging: TapeAndReel; partid: 49838; Part Status: Active; price: 0.21; series: GMC; Size / Dimension: 0.079" L x 0.049" W (2.00mm x 1.25mm); Supplier 1: DigiKey; Supplier Part Number 1: 4713-GMC21X5R226M35NTCT-ND; Temperature Coefficient: X5R; Thickness (Max): 0.057" (1.45mm); Voltage - Rated: 35V
D6 = LR Q976.01-P2R2-1: as D3 on sheet Supply_5V0; Part Number: LR Q976.01-P2R2-1; Color: Red; ComponentLink2Description: DigiKey Link; ComponentLink2URL: https://www.digikey.com/en/products/detail/ams-osram-usa-inc/LR-Q976-01-P2R2-1/21556490; Device Package: 0603 (1608 Metric); Height (Max): 0.75mm; LastUpdated: 2024-06-03 19:59:37; Lens Transparency: Clear; Lifecycle Status: Active; Minimum Order: 1; Mounting Type: Surface Mount; Package / Case: 0603 (1608 Metric); Packaging: TapeAndReel; PartId: 1467; Price: 0.02; Series: LO Q976.01; Size / Dimension: 1.60mm L x 0.80mm W; Supplier 1: DigiKey; Supplier Part Number 1: 475-LRQ976.01-P2R2-1CT-ND; Supplier Device Package: 0603; Value: Red
Q1 = IPD068P03L3 G: P-Channel OptiMOS P3 Power-Transistor, -30 V VDS, -70 A ID, -55 to 175 degC, PG-TO252-3-1, Reel, Green; Manufacturer: Infineon; VGS(th) (min): -1Â V; RDS (on) (max): 6.8Â mOhm; Pto t (max): 100Â W; RDS (on) (max) (@4.5V): 11Â mOhm; VGS(th) (max): -2Â V; VDS (max): -30Â V; Green: TRUE; ID (max): -70Â A; IDpuls (max): -280Â A; Rth: 1.5Â K/W; RthJC (max): 1.5 K/W; QG: 68Â nC; PartNumber: IPD068P03L3 G; ComponentLink1Description: Manufacturer URL; ComponentLink2Description: Datasheet; DatasheetVersion: Rev. 2.0; ComponentLink3URL: http://www.infineon.com/dgdl/TLE42744_DS_11.pdf?folderId=db3a304318f3fe290118f5a433570040&fileId=db3a304327b897500128012ccafe37d2&sId=db3a30443d67b5ca013d83f7c0ea327b; ComponentLink1URL: http://www.infineon.com/; Packing: Reel; ComponentLink2URL: http://www.infineon.com/dgdl/IPD068P03L3+G_2+0.pdf?folderId=db3a304314dca38901154a7313d21a66&fileId=db3a30432313ff5e01232cc234f07d94; ComponentLink3Description: Package Specification; PackageVersion: Jan-10; Mounting Technology: Surface Mount; PackageReference: PG-TO252-3-1; PackageDescription: 3-Pin Plastic (Green) Transistor Single Outline Package, 6.5 x 6.12 mm Body, 2.28 mm Pitch
Q2 = 2N7002: MOSFET N-CH 60V 115MA SOT-23; Manufacturer: ON Semiconductor; Current - Continuous Drain (Id) @ 25°C: 115mA (Ta); Drive Voltage (Max Rds On,  Min Rds On): 5V, 10V; FET Type: N-Channel; Input Capacitance (Ciss) (Max) @ Vds: 50pF @ 25V; Power Dissipation (Max): 200mW (Ta); Rds On (Max) @ Id, Vgs: 7.5Ohm @ 500mA, 10V; Vgs (Max): ±20V; Vgs(th) (Max) @ Id: 2.5V @ 250µA; ComponentLink2Description: DigiKey Link; ComponentLink1URL: https://www.onsemi.com/pub/Collateral/NDS7002A-D.PDF; ComponentLink1Description: Datasheet; ComponentLink2URL: http://digikey.com/product-detail/en/on-semiconductor/2N7002/2N7002NCT-ND/244664; Part Number: 2N7002; Drain to Source Voltage (Vdss): 60V; LastUpdated: 2024-06-03 20:15:26; Lifecycle Status: Active; Minimum Order: 1; Mounting Type: Surface Mount; Operating Temperature: -55°C ~ 150°C (TJ); Package / Case: TO-236-3, SC-59, SOT-23-3; Packaging: TapeAndReel; Part Status: Active; Price: 0.06; Series: -; Supplier 1: DigiKey; Supplier Part Number 1: 2N7002NCT-ND; Supplier Device Package: SOT-23 (TO-236AB); Technology: MOSFET (Metal Oxide)
R15 = AC0603FR-0710KL: RES SMD 10K OHM 1% 1/10W 0603; Manufacturer: Yageo; Power (Watts): 0.1W, 1/10W; Temperature Coefficient: ±100ppm/°C; Tolerance: ±1%; Value: 10 kOhms; Part Number: AC0603FR-0710KL; ComponentLink1Description: Datasheet; ComponentLink1URL: https://www.yageo.com/upload/media/product/productsearch/datasheet/rchip/PYu-AC_51_RoHS_L_7.pdf; ComponentLink2Description: DigiKey Link; ComponentLink2URL: https://www.digikey.com/en/products/detail/yageo/AC0603FR-0710KL/2827814; Composition: Thick Film; Device Package: 0603 (1608 Metric); Features: Automotive AEC-Q200, Moisture Resistant; Height - Seated (Max): 0.022" (0.55mm); LastUpdated: 2024-07-25 09:19:24; Lifecycle Status: Active; Minimum Order: 1; Number of Terminations: 2; Operating Temperature: -55°C ~ 155°C; Package / Case: 0603 (1608 Metric); Packaging: CutTape; PartId: 17347; Part Status: Active; Price: 0.01; Ratings: AEC-Q200; Resistance: 10 kOhms; Series: AC; Size / Dimension: 0.063" L x 0.031" W (1.60mm x 0.80mm); Supplier 1: DigiKey; Supplier Part Number 1: 311-10KLDCT-ND; Supplier Device Package: 0603
R16 = AC0603FR-0747RL: RES SMD 47 OHM 1% 1/10W 0603; Manufacturer: Yageo; Power (Watts): 0.1W, 1/10W; Temperature Coefficient: ±100ppm/°C; Tolerance: ±1%; Value: 47 Ohms; Part Number: AC0603FR-0747RL; ComponentLink1Description: Datasheet; ComponentLink1URL: https://www.yageo.com/upload/media/product/productsearch/datasheet/rchip/PYu-AC_51_RoHS_L_7.pdf; ComponentLink2Description: DigiKey Link; ComponentLink2URL: https://www.digikey.com/en/products/detail/yageo/AC0603FR-0747RL/2827825; Composition: Thick Film; Device Package: 0603 (1608 Metric); Features: Automotive AEC-Q200, Moisture Resistant; Height - Seated (Max): 0.022" (0.55mm); LastUpdated: 2024-07-25 09:19:23; Lifecycle Status: Active; Minimum Order: 1; Number of Terminations: 2; Operating Temperature: -55°C ~ 155°C; Package / Case: 0603 (1608 Metric); Packaging: CutTape; PartId: 17426; Part Status: Active; Price: 0.01; Ratings: AEC-Q200; Resistance: 47 Ohms; Series: AC; Size / Dimension: 0.063" L x 0.031" W (1.60mm x 0.80mm); Supplier 1: DigiKey; Supplier Part Number 1: 311-47LDCT-ND; Supplier Device Package: 0603
R17 = RV0603FR-0710KL: RES SMD 10K OHM 1% 1/10W 0603; Manufacturer: Yageo; Power (Watts): 0.1W, 1/10W; Temperature Coefficient: ±200ppm/°C; Tolerance: ±1%; Value: 10 kOhms; Part Number: RV0603FR-0710KL; ComponentLink1Description: Datasheet; ComponentLink1URL: https://www.yageo.com/upload/media/product/productsearch/datasheet/rchip/PYu-RV_51_RoHS_L_12.pdf; ComponentLink2Description: DigiKey Link; ComponentLink2URL: https://www.digikey.com/en/products/detail/yageo/RV0603FR-0710KL/5947844; Composition: Thick Film; Device Package: 0603 (1608 Metric); Features: Automotive AEC-Q200, High Voltage; Height - Seated (Max): 0.022" (0.55mm); LastUpdated: 2024-07-25 09:18:51; Lifecycle Status: Active; Minimum Order: 1; Number of Terminations: 2; Operating Temperature: -55°C ~ 155°C; Package / Case: 0603 (1608 Metric); Packaging: TapeAndReel; PartId: 86537; Price: 0.03; Ratings: AEC-Q200; Resistance: 10 kOhms; Series: RV; Size / Dimension: 0.063" L x 0.031" W (1.60mm x 0.80mm); Supplier 1: DigiKey; Supplier Part Number 1: 13-RV0603FR-0710KLCT-ND; Supplier Device Package: 0603
R18 = RC0603FR-0747RL: RES 47 OHM 1% 1/10W 0603; Manufacturer: Yageo; Power (Watts): 0.1W, 1/10W; Temperature Coefficient: ±100ppm/°C; Tolerance: ±1%; Value: 47 Ohms; Part Number: RC0603FR-0747RL; ComponentLink1Description: Datasheet; ComponentLink1URL: https://www.yageo.com/upload/media/product/productsearch/datasheet/rchip/PYu-RC_Group_51_RoHS_L_10.pdf; ComponentLink2Description: DigiKey Link; ComponentLink2URL: https://www.digikey.com/en/products/detail/yageo/RC0603FR-0747RL/727252; Composition: Thick Film; Device Package: 0603 (1608 Metric); Features: Moisture Resistant; Height - Seated (Max): 0.022" (0.55mm); LastUpdated: 2024-07-25 09:19:21; Lifecycle Status: Active; Minimum Order: 1; Number of Terminations: 2; Operating Temperature: -55°C ~ 155°C; Package / Case: 0603 (1608 Metric); Packaging: CutTape; PartId: 18960; Part Status: Active; Price: 0.01; Resistance: 47 Ohms; Series: RC_L; Size / Dimension: 0.063" L x 0.031" W (1.60mm x 0.80mm); Supplier 1: DigiKey; Supplier Part Number 1: 311-47.0HRCT-ND; Supplier Device Package: 0603
R19 = RT0603CRE0710KL: RES SMD 10K OHM 0.25% 1/10W 0603; Manufacturer: Yageo; Power (Watts): 0.1W, 1/10W; Temperature Coefficient: ±50ppm/°C; Tolerance: ±0.25%; Value: 10 kOhms; Part Number: RT0603CRE0710KL; ComponentLink1Description: Datasheet; ComponentLink1URL: https://www.yageo.com/upload/media/product/productsearch/datasheet/rchip/PYu-RT_1-to-0.01_RoHS_L_11.pdf; ComponentLink2Description: DigiKey Link; ComponentLink2URL: https://www.digikey.com/en/products/detail/yageo/RT0603CRE0710KL/1073729; Composition: Thin Film; Device Package: 0603 (1608 Metric); Height - Seated (Max): 0.022" (0.55mm); LastUpdated: 2024-07-25 09:19:25; Lifecycle Status: Active; Minimum Order: 1; Number of Terminations: 2; Operating Temperature: -55°C ~ 155°C; Package / Case: 0603 (1608 Metric); Packaging: TapeAndReel; PartId: 16408; Part Status: Active; Price: 0.04; Resistance: 10 kOhms; Series: RT; Size / Dimension: 0.063" L x 0.031" W (1.60mm x 0.80mm); Supplier 1: DigiKey; Supplier Part Number 1: YAG4794CT-ND; Supplier Device Package: 0603

## Sheet BLDC_ext.SchDoc
size Letter
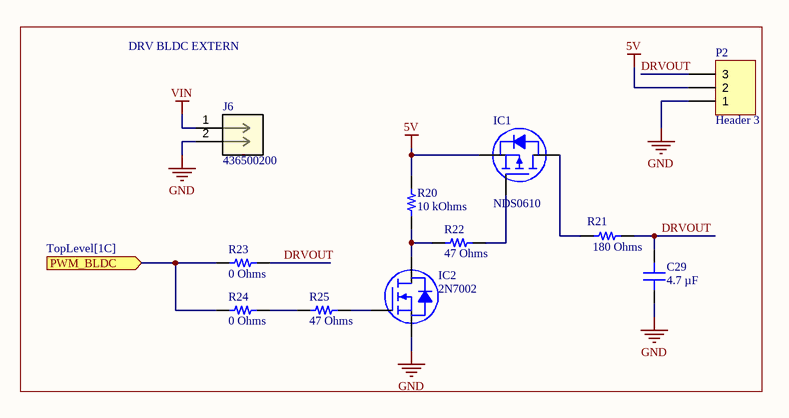
[diagram p6: BLDC_ext.SchDoc]

### Parts
C29  4.7 µF  [CAP 0805_2012]
IC1  NDS0610  [ON SEMI SOT-23-3]
IC2  2N7002  [ON SEMI SOT-23-3]
J6  436500200  [CONN_SD-43650-001_02_MOL]
P2  Header 3  [HDR1X3]
R20  10 kOhms  [YAGEO RES 0603_1608]
R21  180 Ohms  [YAGEO RES 0603_1608]
R22  47 Ohms  [YAGEO RES 0603_1608]
R23  0 Ohms  [YAGEO RES 0603_1608]
R24  0 Ohms  [YAGEO RES 0603_1608]
R25  47 Ohms  [YAGEO RES 0603_1608]

### Blocks framed on the sheet
DRV BLDC EXTERN: C29 IC1 IC2 J6 P2 R20-R25

### Ports
PWM_BLDC (in, see TopLevel[1C])

### Nets
5V: IC1.2(S) P2.2 R20.2
GND: C29.1 IC2.2(S) J6.2 P2.1
VIN: J6.1
BLDC_E: R23.1 R24.1 ; port PWM_BLDC
DRVOUT: C29.2 P2.3 R21.2 R23.2
NetIC1_1: IC1.1(G) R22.2
NetIC1_3: IC1.3(D) R21.1
NetIC2_1: IC2.1(G) R25.2
NetIC2_3: IC2.3(D) R20.1 R22.1
NetR24_2: R24.2 R25.1

### Notes on the sheet
- DWG. NO.
- REV.
- SHT.
- REVISION
- DESCRIPTION
- DATE
- APPROVED
- THIS DOCUMENT AND THE DATA DISCLOSED HEREIN OR HEREWITH IS THE PROPERTY OF ALTIUM LIMITED AND MAY BE FREELY DISTRIBUTED IN WHOLE. NO RIGHTS ARE RESERVED OR EXPRESS OR IMPLIED WARANTEE GIVEN.
- ENG:
- DSN:
- APPROVALS
- PROJECT
- DOCUMENT REVISION:
- DESIGN ITEM:
- CHK:
- BOM:
- REFERENCE DOCUMENTS
- PROJECT REVISION:
- TITLE
- FAB DWG:
- PCB DWG:
- ASSY DWG:
- SCALE:
- SIZE
- C
- CAGE CODE
- FILE NAME
- DWG NO.
- SHEET
- OF
- REV

### Library data of the parts
C29 = C0805X475J9RACAUTO: CAP CER 4.7UF 6.3V X7R 0805; manufacturer: KEMET; Tolerance: ±5%; Part Number: C0805X475J9RACAUTO; Applications: Automotive, Boardflex Sensitive; componentlink1description: Datasheet; componentlink1url: https://api.kemet.com/component-edge/download/datasheet/C0805X475J9RACAUTO.pdf; componentlink2description: DigiKey Link; componentlink2url: https://www.digikey.com/en/products/detail/kemet/C0805X475J9RACAUTO/7427557; Device Package: 0805 (2012 Metric); Features: Soft Termination; lastupdated: 2024-02-09 20:16:08; Lifecycle Status: Active; Minimum Order: 1; Mounting Type: Surface Mount, MLCC; Operating Temperature: -55°C ~ 125°C; Package / Case: 0805 (2012 Metric); packaging: TapeAndReel; partid: 2889; Part Status: Active; price: 0.20; Ratings: AEC-Q200; series: SMD Auto X7R Flex; Size / Dimension: 0.079" L x 0.049" W (2.00mm x 1.25mm); Supplier 1: DigiKey; Supplier Part Number 1: 399-15727-1-ND; Temperature Coefficient: X7R; Thickness (Max): 0.057" (1.45mm); value: 4.7 µF; Voltage - Rated: 6.3V
IC1 = NDS0610: MOSFET P-CH 60V 120MA SOT-23; Manufacturer: ON Semiconductor; Current - Continuous Drain (Id) @ 25°C: 120mA (Ta); Drive Voltage (Max Rds On,  Min Rds On): 4.5V, 10V; FET Type: P-Channel; Gate Charge (Qg) (Max) @ Vgs: 2.5nC @ 10V; Input Capacitance (Ciss) (Max) @ Vds: 79pF @ 25V; Power Dissipation (Max): 360mW (Ta); Rds On (Max) @ Id, Vgs: 10Ohm @ 500mA, 10V; Vgs (Max): ±20V; Vgs(th) (Max) @ Id: 3.5V @ 1mA; Part Number: NDS0610; ComponentLink1Description: Datasheet; ComponentLink1URL: https://www.onsemi.com/pub/Collateral/NDS0610-D.PDF; ComponentLink2Description: DigiKey Link; ComponentLink2URL: http://digikey.com/product-detail/en/on-semiconductor/NDS0610/NDS0610CT-ND/244299; Drain to Source Voltage (Vdss): 60V; LastUpdated: 2024-06-03 20:15:27; Lifecycle Status: Active; Minimum Order: 1; Mounting Type: Surface Mount; Operating Temperature: -55°C ~ 150°C (TJ); Package / Case: TO-236-3, SC-59, SOT-23-3; Packaging: TapeAndReel; Part Status: Active; Price: 0.06; Series: -; Supplier 1: DigiKey; Supplier Part Number 1: NDS0610CT-ND; Supplier Device Package: SOT-23; Technology: MOSFET (Metal Oxide)
IC2 = 2N7002: as Q2 on sheet PowerOut; Part Number: 2N7002; ComponentLink1Description: Datasheet; ComponentLink1URL: https://www.onsemi.com/pub/Collateral/NDS7002A-D.PDF; ComponentLink2Description: DigiKey Link; ComponentLink2URL: http://digikey.com/product-detail/en/on-semiconductor/2N7002/2N7002NCT-ND/244664; Drain to Source Voltage (Vdss): 60V; LastUpdated: 2024-06-03 20:15:26; Lifecycle Status: Active; Minimum Order: 1; Mounting Type: Surface Mount; Operating Temperature: -55°C ~ 150°C (TJ); Package / Case: TO-236-3, SC-59, SOT-23-3; Packaging: TapeAndReel; Part Status: Active; Price: 0.06; Series: -; Supplier 1: DigiKey; Supplier Part Number 1: 2N7002NCT-ND; Supplier Device Package: SOT-23 (TO-236AB); Technology: MOSFET (Metal Oxide)
J6 = 436500200: as J5 on sheet TopLevel; RefDes: RefDes; Type: Type
P2 = Header 3: Header, 3-Pin; LatestRevisionDate: 17-Jul-2002; LatestRevisionNote: Re-released for DXP Platform.; Publisher: Altium Limited
R20 = RT0603DRD0710KL: RES SMD 10K OHM 0.5% 1/10W 0603; Manufacturer: Yageo; Power (Watts): 0.1W, 1/10W; Temperature Coefficient: ±25ppm/°C; Part Number: RT0603DRD0710KL; Value: 10 kOhms; ComponentLink1Description: Datasheet; ComponentLink1URL: https://www.yageo.com/upload/media/product/productsearch/datasheet/rchip/PYu-RT_1-to-0.01_RoHS_L_11.pdf; ComponentLink2Description: DigiKey Link; ComponentLink2URL: https://www.digikey.com/en/products/detail/yageo/RT0603DRD0710KL/1035416; Composition: Thin Film; Device Package: 0603 (1608 Metric); Height - Seated (Max): 0.022" (0.55mm); LastUpdated: 2024-07-25 09:19:32; Lifecycle Status: Active; Minimum Order: 1; Number of Terminations: 2; Operating Temperature: -55°C ~ 155°C; Package / Case: 0603 (1608 Metric); Packaging: TapeAndReel; PartId: 5487; Part Status: Active; Price: 0.02; Resistance: 10 kOhms; Series: RT; Size / Dimension: 0.063" L x 0.031" W (1.60mm x 0.80mm); Supplier 1: DigiKey; Supplier Part Number 1: 311-10KDCT-ND; Supplier Device Package: 0603; Tolerance: ±0.5%
R21 = RT0603BRD07180RL: RES SMD 180 OHM 0.1% 1/10W 0603; Manufacturer: Yageo; Power (Watts): 0.1W, 1/10W; Temperature Coefficient: ±25ppm/°C; Part Number: RT0603BRD07180RL; Value: 180 Ohms; ComponentLink1Description: Datasheet; ComponentLink1URL: https://www.yageo.com/upload/media/product/productsearch/datasheet/rchip/PYu-RT_1-to-0.01_RoHS_L_11.pdf; ComponentLink2Description: DigiKey Link; ComponentLink2URL: https://www.digikey.com/en/products/detail/yageo/RT0603BRD07180RL/1072294; Composition: Thin Film; Device Package: 0603 (1608 Metric); Height - Seated (Max): 0.022" (0.55mm); LastUpdated: 2024-07-25 09:19:32; Lifecycle Status: Active; Minimum Order: 1; Number of Terminations: 2; Operating Temperature: -55°C ~ 155°C; Package / Case: 0603 (1608 Metric); Packaging: TapeAndReel; PartId: 6294; Part Status: Active; Price: 0.03; Resistance: 180 Ohms; Series: RT; Size / Dimension: 0.063" L x 0.031" W (1.60mm x 0.80mm); Supplier 1: DigiKey; Supplier Part Number 1: YAG1549CT-ND; Supplier Device Package: 0603; Tolerance: ±0.1%
R22 R25 = SR0603JR-7T47RL: RES 47 OHM 5% 1/4W 0603; Manufacturer: Yageo; Power (Watts): 0.25W, 1/4W; Temperature Coefficient: ±100ppm/°C; Part Number: SR0603JR-7T47RL; Value: 47 Ohms; ComponentLink1Description: Datasheet; ComponentLink1URL: http://www.yageo.com/NewPortal/_en/search/productDocs.jsp?YageoPartNumber=SR0603JR-7T47RL; ComponentLink2Description: DigiKey Link; ComponentLink2URL: https://www.digikey.com/en/products/detail/yageo/SR0603JR-7T47RL/9696400; Composition: Thick Film; Device Package: 0603 (1608 Metric); Features: Automotive AEC-Q200, Pulse Withstanding; Height - Seated (Max): 0.022" (0.55mm); LastUpdated: 2024-07-25 09:19:30; Lifecycle Status: Active; Minimum Order: 1; Number of Terminations: 2; Operating Temperature: -55°C ~ 155°C; Package / Case: 0603 (1608 Metric); Packaging: TapeAndReel; PartId: 8875; Part Status: Active; Price: 0.03; Ratings: AEC-Q200; Resistance: 47 Ohms; Series: SR; Size / Dimension: 0.063" L x 0.031" W (1.60mm x 0.80mm); Supplier 1: DigiKey; Supplier Part Number 1: YAG6162CT-ND; Supplier Device Package: 0603; Tolerance: ±5%
R23 R24 = PA0603-R-070RL: RES 0 OHM JUMPER 1/2W 0603; Manufacturer: Yageo; Power (Watts): 0.1W, 1/10W; Temperature Coefficient: ±150ppm/°C; Part Number: PA0603-R-070RL; Value: 0 Ohms; ComponentLink1Description: Datasheet; ComponentLink1URL: http://www.yageo.com/NewPortal/_en/search/productDocs.jsp?YageoPartNumber=PA0603-R-070RL; ComponentLink2Description: DigiKey Link; ComponentLink2URL: https://www.digikey.com/en/products/detail/yageo/PA0603-R-070RL/8255972; Composition: Metal Element; Device Package: 0603 (1608 Metric); Features: Automotive AEC-Q200, Current Sense; Height - Seated (Max): 0.024" (0.60mm); LastUpdated: 2024-07-25 09:19:32; Lifecycle Status: Active; Minimum Order: 1; Number of Terminations: 2; Operating Temperature: -55°C ~ 155°C; Package / Case: 0603 (1608 Metric); Packaging: TapeAndReel; PartId: 4862; Part Status: Active; Price: 0.08; Resistance: 0 Ohms; Series: PA; Size / Dimension: 0.063" L x 0.031" W (1.60mm x 0.80mm); Supplier 1: DigiKey; Supplier Part Number 1: YAG5757CT-ND; Supplier Device Package: 0603; Tolerance: Jumper